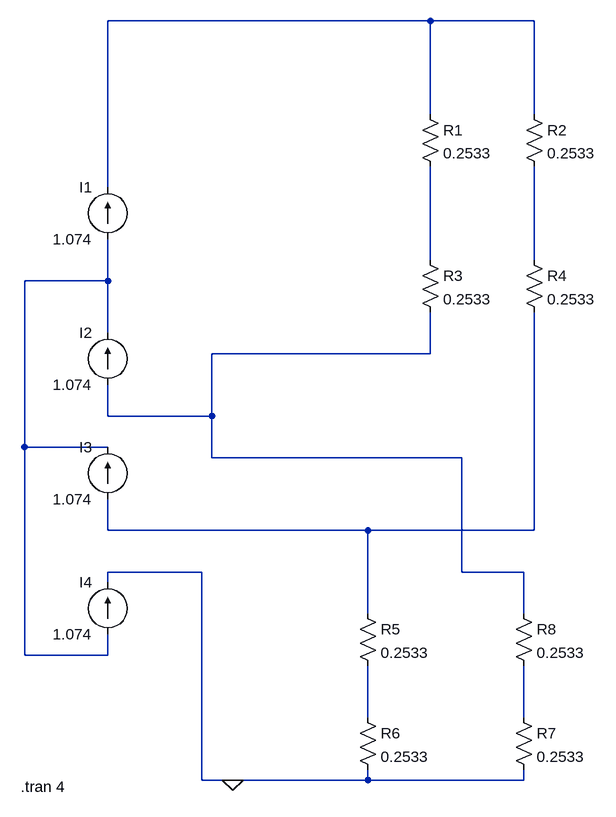
[diagram p0: schematic Draft1.asc]
Draft1.asc, the LTspice schematic file:
Version 4
SHEET 1 880 1140
WIRE 80 -48 -416 -48
WIRE 240 -48 80 -48
WIRE 80 96 80 -48
WIRE 240 96 240 -48
WIRE -416 208 -416 -48
WIRE 80 320 80 176
WIRE 240 320 240 176
WIRE -416 352 -416 288
WIRE -416 352 -544 352
WIRE -416 432 -416 352
WIRE 80 464 80 400
WIRE 80 464 -256 464
WIRE -416 560 -416 512
WIRE -256 560 -256 464
WIRE -256 560 -416 560
WIRE -544 608 -544 352
WIRE -416 608 -544 608
WIRE -256 624 -256 560
WIRE 128 624 -256 624
WIRE -416 736 -416 688
WIRE -16 736 -416 736
WIRE 240 736 240 400
WIRE 240 736 -16 736
WIRE -272 800 -416 800
WIRE 128 800 128 624
WIRE 224 800 128 800
WIRE -416 816 -416 800
WIRE -16 864 -16 736
WIRE 224 864 224 800
WIRE -544 928 -544 608
WIRE -416 928 -416 896
WIRE -416 928 -544 928
WIRE -16 1024 -16 944
WIRE 224 1024 224 944
WIRE -272 1120 -272 800
WIRE -224 1120 -272 1120
WIRE -16 1120 -16 1104
WIRE -16 1120 -224 1120
WIRE 224 1120 224 1104
WIRE 224 1120 -16 1120
FLAG -224 1120 0
SYMBOL res 64 80 R0
SYMATTR InstName R1
SYMATTR Value 0.2533
SYMBOL res 224 80 R0
SYMATTR InstName R2
SYMATTR Value 0.2533
SYMBOL res 64 304 R0
SYMATTR InstName R3
SYMATTR Value 0.2533
SYMBOL res 224 304 R0
SYMATTR InstName R4
SYMATTR Value 0.2533
SYMBOL res -32 848 R0
SYMATTR InstName R5
SYMATTR Value 0.2533
SYMBOL res -32 1008 R0
SYMATTR InstName R6
SYMATTR Value 0.2533
SYMBOL res 208 1008 R0
SYMATTR InstName R7
SYMATTR Value 0.2533
SYMBOL res 208 848 R0
SYMATTR InstName R8
SYMATTR Value 0.2533
SYMBOL current -416 288 R180
WINDOW 0 24 80 Left 2
WINDOW 3 24 0 Left 2
WINDOW 123 0 0 Left 0
WINDOW 39 0 0 Left 0
SYMATTR InstName I1
SYMATTR Value 1.074
SYMBOL current -416 512 R180
WINDOW 0 24 80 Left 2
WINDOW 3 24 0 Left 2
WINDOW 123 0 0 Left 0
WINDOW 39 0 0 Left 0
SYMATTR InstName I2
SYMATTR Value 1.074
SYMBOL current -416 688 R180
WINDOW 0 24 80 Left 2
WINDOW 3 24 0 Left 2
WINDOW 123 0 0 Left 0
WINDOW 39 0 0 Left 0
SYMATTR InstName I3
SYMATTR Value 1.074
SYMBOL current -416 896 R180
WINDOW 0 24 80 Left 2
WINDOW 3 24 0 Left 2
WINDOW 123 0 0 Left 0
WINDOW 39 0 0 Left 0
SYMATTR InstName I4
SYMATTR Value 1.074
TEXT -550 1130 Left 2 !.tran 4

The netlist it stands for:
* Draft1.asc
R1 N001 N002 0.2533
R2 N001 N003 0.2533
R3 N002 N005 0.2533
R4 N003 N006 0.2533
R5 N006 N007 0.2533
R6 N007 0 0.2533
R7 N008 0 0.2533
R8 N005 N008 0.2533
I1 N004 N001 1.074
I2 N005 N004 1.074
I3 N006 N004 1.074
I4 N004 0 1.074
.tran 4
.backanno
.end